# Altium schematic sheet 2.0_GIT_SCHEMATIC.SchDoc
size A4; SheetNumber: 2; SheetTotal: 2
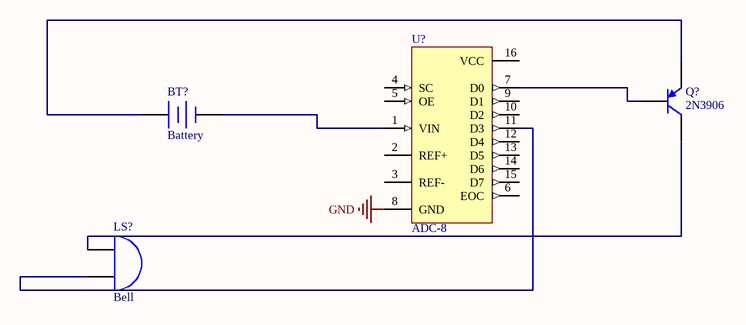
[diagram p0: 2.0_GIT_SCHEMATIC.SchDoc]

## Parts
BT?  Battery  [BAT-2]
LS?  Bell  [PIN2]
Q?  2N3906  [TO-92A]
U?  ADC-8  [SOT403-1_N]

## Nets
GND: U?.8(GND)
NetBT?_1: BT?.1(+) Q?.1(E)
NetBT?_2: BT?.2(-) U?.1(VIN)
NetLS?_1: LS?.1(A) Q?.3(C)
NetLS?_2: LS?.2(B) U?.11(D3)
NetQ?_2: Q?.2(B) U?.7(D0)

Not connected (* = marked no-connect by the designer): U? 2(REF+) 3(REF-) 4(SC) 5(OE) 6(EOC) 9(D1) 10(D2) 12(D4) 13(D5) 14(D6) 15(D7) 16(VCC)

## Library data of the parts
BT? = Battery: Multicell Battery; Published: 24-Mar-1999; LatestRevisionDate: 17-Jul-2002; LatestRevisionNote: Re-released for DXP Platform.; PackageReference: BAT-2; Publisher: Altium Limited; PackageDescription: Battery; 2 Leads
LS? = Bell: Electrical Bell; Published: 24-Mar-1999; LatestRevisionDate: 17-Jul-2002; LatestRevisionNote: Re-released for DXP Platform.; PackageReference: PIN2; Publisher: Altium Limited
Q? = 2N3906: PNP General Purpose Amplifier; Published: 8-Jun-2000; LatestRevisionDate: 15-Jan-2003; LatestRevisionNote: PCB Footprint 'BCY-W3/D4.7' replaced; DatasheetVersion: 1997; PackageVersion: Sep-1998; PackageReference: TO-92A; Publisher: Altium Limited; PackageDescription: TO, Flat Index; 3 In-Line, Axial Leads; Body Dia. 4.5mm; Leads 0.51 x 0.48 mm (max); ComponentLink1Description: Manufacturer Link; ComponentLink1URL: http://www.fairchildsemi.com/; ComponentLink2Description: Datasheet; ComponentLink2URL: http://www.fairchildsemi.com/ds/2N%2F2N3906.pdf
U? = ADC-8: Generic 8-Bit A/D Converter; Published: 8-Jun-2000; LatestRevisionDate: 29-May-2009; LatestRevisionNote: IPC-7351 Footprint Added.; PackageVersion: Mar-2002; PackageReference: SOT403-1; Publisher: Altium Limited; PackageDescription: 16-Pin Thin Small Outline Package 0.65 mm Pitch; Code_JEDEC: MO-153